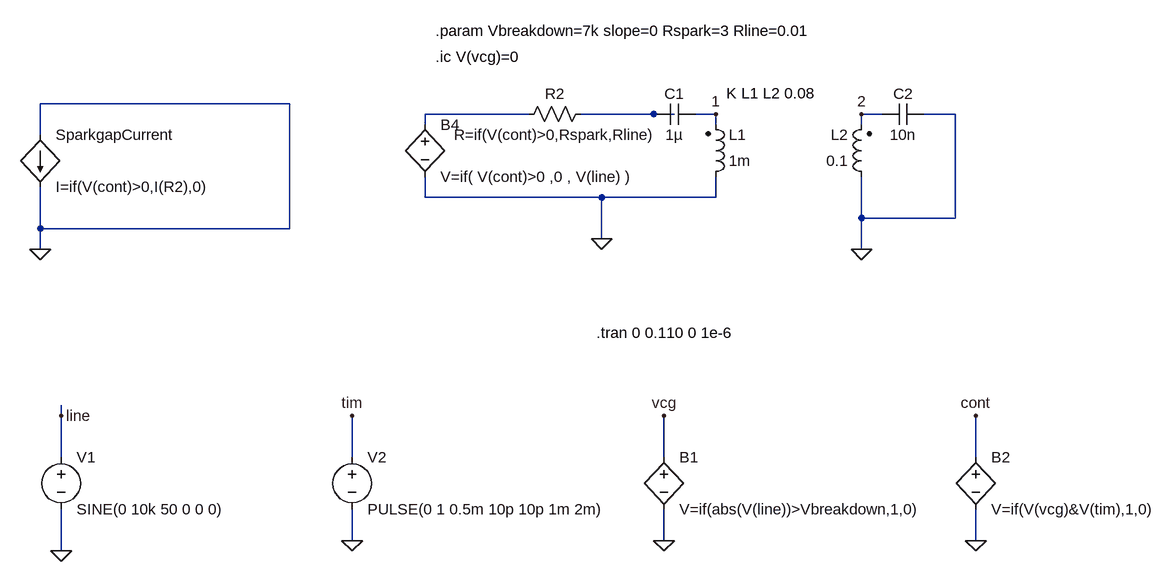
[diagram p0: schematic TeslaCoil.asc]
TeslaCoil.asc, the LTspice schematic file:
Version 4
SHEET 1 2700 756
WIRE -4352 -912 -4736 -912
WIRE -3984 -896 -4144 -896
WIRE -3792 -896 -3904 -896
WIRE -3760 -896 -3792 -896
WIRE -3696 -896 -3728 -896
WIRE -3440 -896 -3472 -896
WIRE -3328 -896 -3376 -896
WIRE -4144 -880 -4144 -896
WIRE -3696 -880 -3696 -896
WIRE -3472 -880 -3472 -896
WIRE -4736 -864 -4736 -912
WIRE -4144 -768 -4144 -800
WIRE -3872 -768 -4144 -768
WIRE -3696 -768 -3696 -800
WIRE -3696 -768 -3872 -768
WIRE -3472 -736 -3472 -800
WIRE -3328 -736 -3328 -896
WIRE -3328 -736 -3472 -736
WIRE -4736 -720 -4736 -784
WIRE -4352 -720 -4352 -912
WIRE -4352 -720 -4736 -720
WIRE -3872 -704 -3872 -768
WIRE -4736 -688 -4736 -720
WIRE -3472 -688 -3472 -736
WIRE -4704 -432 -4704 -448
WIRE -4704 -368 -4704 -432
WIRE -4256 -368 -4256 -432
WIRE -3776 -368 -3776 -432
WIRE -3296 -368 -3296 -432
WIRE -4256 -240 -4256 -288
WIRE -3776 -240 -3776 -288
WIRE -3296 -240 -3296 -288
WIRE -4704 -224 -4704 -288
FLAG -3472 -896 2
FLAG -3696 -896 1
FLAG -3872 -704 0
FLAG -3472 -688 0
FLAG -4704 -224 0
FLAG -4704 -432 line
FLAG -3776 -240 0
FLAG -3776 -432 vcg
FLAG -4256 -240 0
FLAG -4256 -432 tim
FLAG -3296 -240 0
FLAG -3296 -432 cont
FLAG -4736 -688 0
SYMBOL ind2 -3712 -784 M180
WINDOW 0 36 80 Left 2
WINDOW 3 36 40 Left 2
SYMATTR InstName L1
SYMATTR Value 1m
SYMATTR Type ind
SYMBOL cap -3728 -912 R90
WINDOW 0 0 32 VBottom 2
WINDOW 3 32 32 VTop 2
SYMATTR InstName C1
SYMATTR Value 1µ
SYMBOL ind2 -3456 -784 R180
WINDOW 0 36 80 Left 2
WINDOW 3 36 40 Left 2
SYMATTR InstName L2
SYMATTR Value 0.1
SYMATTR Type ind
SYMBOL cap -3440 -880 R270
WINDOW 0 32 32 VTop 2
WINDOW 3 0 32 VBottom 2
SYMATTR InstName C2
SYMATTR Value 10n
SYMBOL voltage -4704 -384 R0
WINDOW 123 0 0 Left 0
WINDOW 39 0 0 Left 0
SYMATTR InstName V1
SYMATTR Value SINE(0 10k 50 0 0 0)
SYMBOL res -4000 -880 R270
WINDOW 0 32 56 VTop 2
WINDOW 3 0 56 VBottom 2
SYMATTR InstName R2
SYMATTR Value R=if(V(cont)>0,Rspark,Rline)
SYMBOL bv -4144 -896 R0
SYMATTR InstName B4
SYMATTR Value V=if( V(cont)>0 ,0 , V(line) )
SYMBOL bv -3776 -384 R0
SYMATTR InstName B1
SYMATTR Value V=if(abs(V(line))>Vbreakdown,1,0)
SYMBOL voltage -4256 -384 R0
WINDOW 123 0 0 Left 0
WINDOW 39 0 0 Left 0
SYMATTR InstName V2
SYMATTR Value PULSE(0 1 0.5m 10p 10p 1m 2m)
SYMBOL bv -3296 -384 R0
SYMATTR InstName B2
SYMATTR Value V=if(V(vcg)&V(tim),1,0)
SYMBOL bi -4736 -864 R0
SYMATTR InstName SparkgapCurrent
SYMATTR Value I=if(V(cont)>0,I(R2),0)
TEXT -3680 -928 Left 2 !K L1 L2 0.08
TEXT -3880 -560 Left 2 !.tran 0 0.110 0 1e-6
TEXT -4128 -1024 Left 2 !.param Vbreakdown=7k slope=0 Rspark=3 Rline=0.01
TEXT -4128 -984 Left 2 !.ic V(vcg)=0

The netlist it stands for:
* TeslaCoil.asc
L1 0 1 1m
C1 1 N002 1µ
L2 0 2 0.1
C2 2 0 10n
V1 line 0 SINE(0 10k 50 0 0 0)
R2 N001 N002 R=if(V(cont)>0,Rspark,Rline)
B4 N001 0 V=if( V(cont)>0 ,0 , V(line) )
B1 vcg 0 V=if(abs(V(line))>Vbreakdown,1,0)
V2 tim 0 PULSE(0 1 0.5m 10p 10p 1m 2m)
B2 cont 0 V=if(V(vcg)&V(tim),1,0)
B§SparkgapCurrent 0 0 I=if(V(cont)>0,I(R2),0)
K L1 L2 0.08
.tran 0 0.110 0 1e-6
.param Vbreakdown=7k slope=0 Rspark=3 Rline=0.01
.ic V(vcg)=0
.backanno
.end